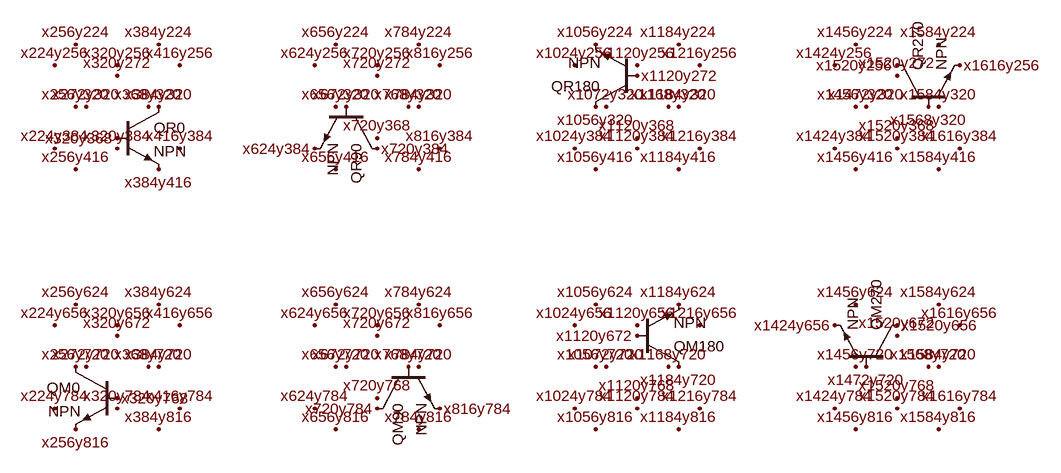
[diagram p0: schematic orientation_npn.asc]
orientation_npn.asc, the LTspice schematic file:
Version 4
SHEET 1 2000 1200
FLAG 256 320 x256y320
FLAG 320 256 x320y256
FLAG 320 384 x320y384
FLAG 384 320 x384y320
FLAG 272 320 x272y320
FLAG 320 272 x320y272
FLAG 320 368 x320y368
FLAG 368 320 x368y320
FLAG 224 256 x224y256
FLAG 224 384 x224y384
FLAG 256 224 x256y224
FLAG 256 416 x256y416
FLAG 384 224 x384y224
FLAG 384 416 x384y416
FLAG 416 256 x416y256
FLAG 416 384 x416y384
FLAG 656 320 x656y320
FLAG 720 256 x720y256
FLAG 720 384 x720y384
FLAG 784 320 x784y320
FLAG 672 320 x672y320
FLAG 720 272 x720y272
FLAG 720 368 x720y368
FLAG 768 320 x768y320
FLAG 624 256 x624y256
FLAG 624 384 x624y384
FLAG 656 224 x656y224
FLAG 656 416 x656y416
FLAG 784 224 x784y224
FLAG 784 416 x784y416
FLAG 816 256 x816y256
FLAG 816 384 x816y384
FLAG 1056 320 x1056y320
FLAG 1120 256 x1120y256
FLAG 1120 384 x1120y384
FLAG 1184 320 x1184y320
FLAG 1072 320 x1072y320
FLAG 1120 272 x1120y272
FLAG 1120 368 x1120y368
FLAG 1168 320 x1168y320
FLAG 1024 256 x1024y256
FLAG 1024 384 x1024y384
FLAG 1056 224 x1056y224
FLAG 1056 416 x1056y416
FLAG 1184 224 x1184y224
FLAG 1184 416 x1184y416
FLAG 1216 256 x1216y256
FLAG 1216 384 x1216y384
FLAG 1456 320 x1456y320
FLAG 1520 256 x1520y256
FLAG 1520 384 x1520y384
FLAG 1584 320 x1584y320
FLAG 1472 320 x1472y320
FLAG 1520 272 x1520y272
FLAG 1520 368 x1520y368
FLAG 1568 320 x1568y320
FLAG 1424 256 x1424y256
FLAG 1424 384 x1424y384
FLAG 1456 224 x1456y224
FLAG 1456 416 x1456y416
FLAG 1584 224 x1584y224
FLAG 1584 416 x1584y416
FLAG 1616 256 x1616y256
FLAG 1616 384 x1616y384
FLAG 256 720 x256y720
FLAG 320 656 x320y656
FLAG 320 784 x320y784
FLAG 384 720 x384y720
FLAG 272 720 x272y720
FLAG 320 672 x320y672
FLAG 320 768 x320y768
FLAG 368 720 x368y720
FLAG 224 656 x224y656
FLAG 224 784 x224y784
FLAG 256 624 x256y624
FLAG 256 816 x256y816
FLAG 384 624 x384y624
FLAG 384 816 x384y816
FLAG 416 656 x416y656
FLAG 416 784 x416y784
FLAG 656 720 x656y720
FLAG 720 656 x720y656
FLAG 720 784 x720y784
FLAG 784 720 x784y720
FLAG 672 720 x672y720
FLAG 720 672 x720y672
FLAG 720 768 x720y768
FLAG 768 720 x768y720
FLAG 624 656 x624y656
FLAG 624 784 x624y784
FLAG 656 624 x656y624
FLAG 656 816 x656y816
FLAG 784 624 x784y624
FLAG 784 816 x784y816
FLAG 816 656 x816y656
FLAG 816 784 x816y784
FLAG 1056 720 x1056y720
FLAG 1120 656 x1120y656
FLAG 1120 784 x1120y784
FLAG 1184 720 x1184y720
FLAG 1072 720 x1072y720
FLAG 1120 672 x1120y672
FLAG 1120 768 x1120y768
FLAG 1168 720 x1168y720
FLAG 1024 656 x1024y656
FLAG 1024 784 x1024y784
FLAG 1056 624 x1056y624
FLAG 1056 816 x1056y816
FLAG 1184 624 x1184y624
FLAG 1184 816 x1184y816
FLAG 1216 656 x1216y656
FLAG 1216 784 x1216y784
FLAG 1456 720 x1456y720
FLAG 1520 656 x1520y656
FLAG 1520 784 x1520y784
FLAG 1584 720 x1584y720
FLAG 1472 720 x1472y720
FLAG 1520 672 x1520y672
FLAG 1520 768 x1520y768
FLAG 1568 720 x1568y720
FLAG 1424 656 x1424y656
FLAG 1424 784 x1424y784
FLAG 1456 624 x1456y624
FLAG 1456 816 x1456y816
FLAG 1584 624 x1584y624
FLAG 1584 816 x1584y816
FLAG 1616 656 x1616y656
FLAG 1616 784 x1616y784
SYMBOL npn 320 320 R0
SYMATTR InstName QR0
SYMBOL npn 720 320 R90
SYMATTR InstName QR90
SYMBOL npn 1120 320 R180
SYMATTR InstName QR180
SYMBOL npn 1520 320 R270
SYMATTR InstName QR270
SYMBOL npn 320 720 M0
SYMATTR InstName QM0
SYMBOL npn 720 720 M90
SYMATTR InstName QM90
SYMBOL npn 1120 720 M180
SYMATTR InstName QM180
SYMBOL npn 1520 720 M270
SYMATTR InstName QM270

The netlist it stands for:
* orientation_npn.asc
QR0 x384y320 x320y368 x384y416 0 NPN
QR90 x720y384 x672y320 x624y384 0 NPN
QR180 x1056y320 x1120y272 x1056y224 0 NPN
QR270 x1520y256 x1568y320 x1616y256 0 NPN
QM0 x256y720 x320y768 x256y816 0 NPN
QM90 x720y784 x768y720 x816y784 0 NPN
QM180 x1184y720 x1120y672 x1184y624 0 NPN
QM270 x1520y656 x1472y720 x1424y656 0 NPN
.model NPN NPN
.model PNP PNP
.lib standard.bjt
.backanno
.end